# EAGLE design UMR2 CS01 r2 TPL (EAGLE 6.6.0)
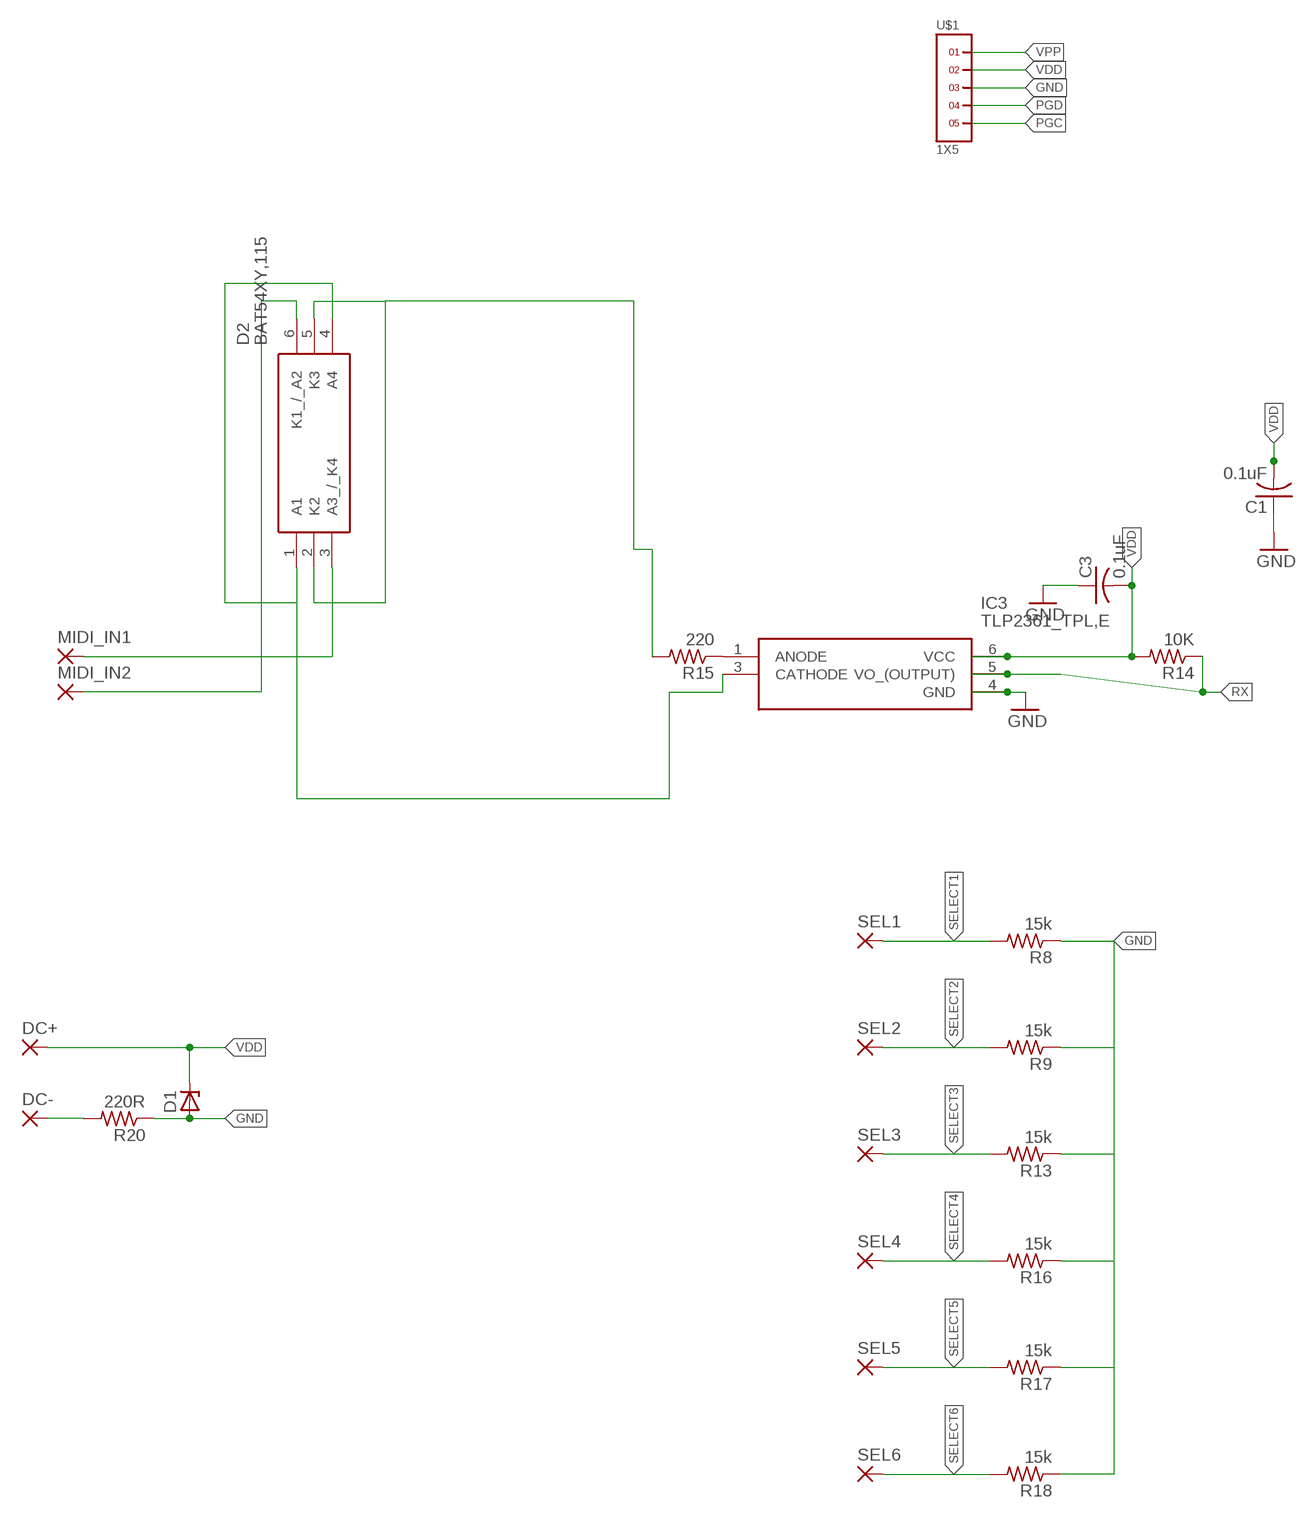
[diagram p0: schematic, sheet 1, part 1 of 2]
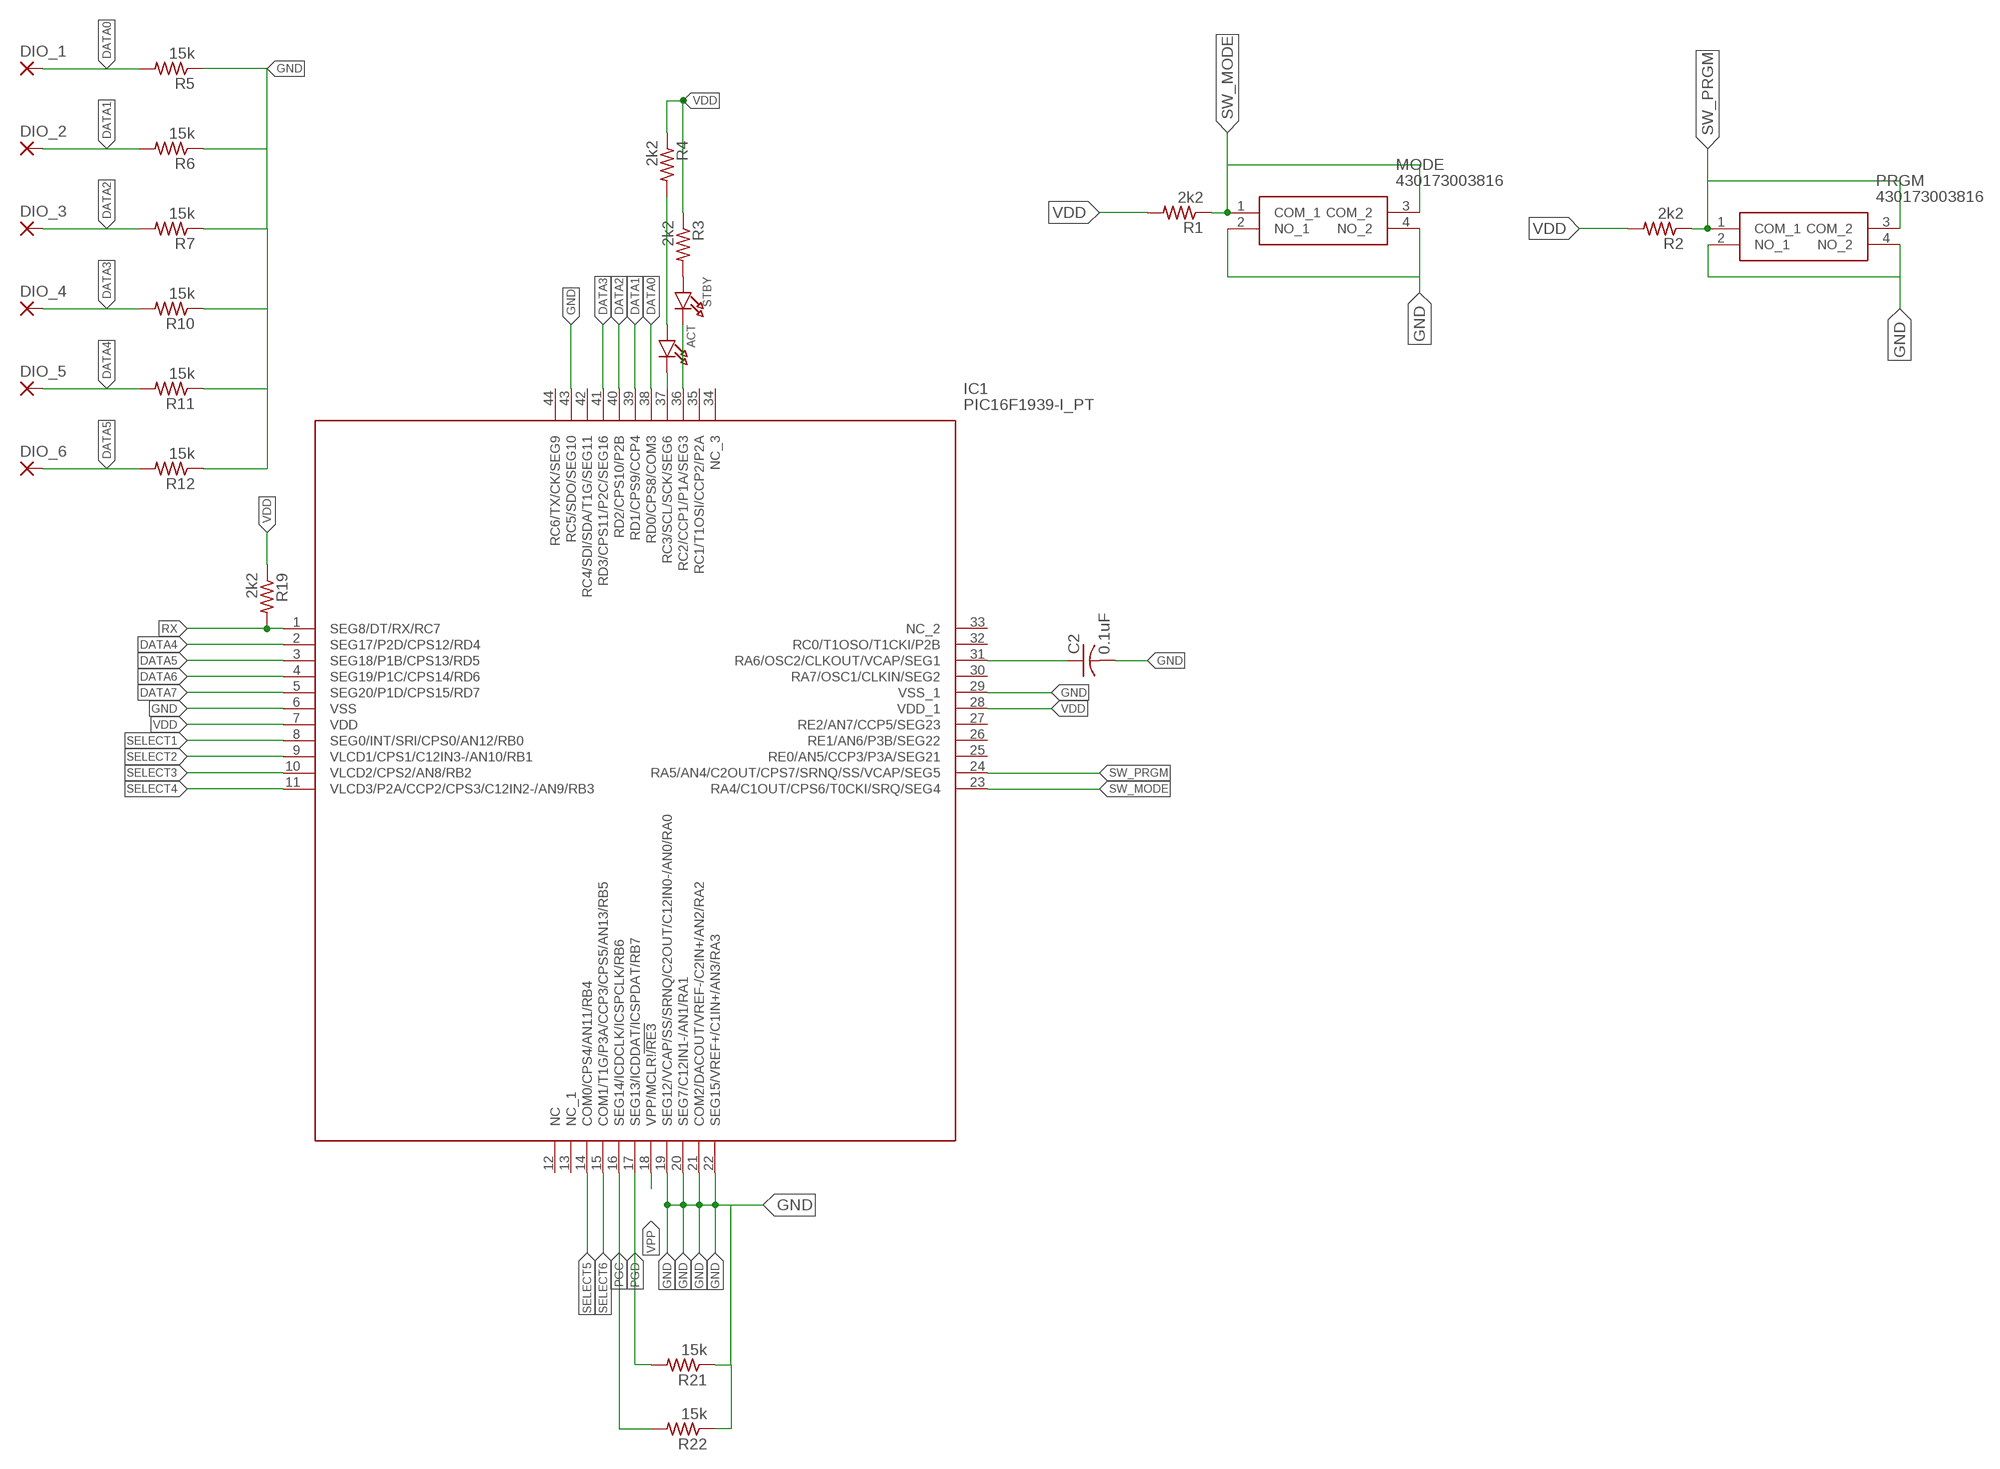
[diagram p1: schematic, sheet 1, part 2 of 2]

## Parts
ACT  LED0603_NOOUTLINE  [CHIPLED_0603_NOOUTLINE]
C1  0.1uF  RCL_C-USC0603  [RCL_C0603]
C2  0.1uF  RCL_C-USC0603  [RCL_C0603]
C3  0.1uF  RCL_C-USC0603  [RCL_C0603]
D1  ZENER_DIODESOD123  [SOD123]
D2  BAT54XY,115  [SOT65P210X110-6N]
DC+  SMD2  [SMD1,27-2,54]
DC-  SMD2  [SMD1,27-2,54]
DIO_1  SMD2  [SMD1,27-2,54]
DIO_2  SMD2  [SMD1,27-2,54]
DIO_3  SMD2  [SMD1,27-2,54]
DIO_4  SMD2  [SMD1,27-2,54]
DIO_5  SMD2  [SMD1,27-2,54]
DIO_6  SMD2  [SMD1,27-2,54]
IC1  PIC16F1939-I_PT  [QFP80P1200X1200X120-44N]
IC3  TLP2361_TPL,E  [11-4L1S(5-PIN-SOIC)]
MIDI_IN1  SMD2  [SMD1,27-2,54]
MIDI_IN2  SMD2  [SMD1,27-2,54]
MODE  430173003816  [430173003816]
PRGM  430173003816  [430173003816]
R1  2k2  RCL_R-US_R0603  [RCL_R0603]
R2  2k2  RCL_R-US_R0603  [RCL_R0603]
R3  2k2  RCL_R-US_R0603  [RCL_R0603]
R4  2k2  RCL_R-US_R0603  [RCL_R0603]
R5  15k  RCL_R-US_R0603  [RCL_R0603]
R6  15k  RCL_R-US_R0603  [RCL_R0603]
R7  15k  RCL_R-US_R0603  [RCL_R0603]
R8  15k  RCL_R-US_R0603  [RCL_R0603]
R9  15k  RCL_R-US_R0603  [RCL_R0603]
R10  15k  RCL_R-US_R0603  [RCL_R0603]
R11  15k  RCL_R-US_R0603  [RCL_R0603]
R12  15k  RCL_R-US_R0603  [RCL_R0603]
R13  15k  RCL_R-US_R0603  [RCL_R0603]
R14  10K  RCL_R-US_R0603  [RCL_R0603]
R15  220  RCL_R-US_R0603  [RCL_R0603]
R16  15k  RCL_R-US_R0603  [RCL_R0603]
R17  15k  RCL_R-US_R0603  [RCL_R0603]
R18  15k  RCL_R-US_R0603  [RCL_R0603]
R19  2k2  RCL_R-US_R0603  [RCL_R0603]
R20  220R  RCL_R-US_R0603  [RCL_R0603]
R21  15k  RCL_R-US_R0603  [RCL_R0603]
R22  15k  RCL_R-US_R0603  [RCL_R0603]
SEL1  SMD2  [SMD1,27-2,54]
SEL2  SMD2  [SMD1,27-2,54]
SEL3  SMD2  [SMD1,27-2,54]
SEL4  SMD2  [SMD1,27-2,54]
SEL5  SMD2  [SMD1,27-2,54]
SEL6  SMD2  [SMD1,27-2,54]
STBY  LED0603_NOOUTLINE  [CHIPLED_0603_NOOUTLINE]
U$1  1X5  [1X5]

## Nets
ACT: ACT.C IC1.37(RC3/SCL/SCK/SEG6)
DATA0: DIO_1.1(P) IC1.38(RD0/CPS8/COM3) R5.2
DATA1: DIO_2.1(P) IC1.39(RD1/CPS9/CCP4) R6.2
DATA2: DIO_3.1(P) IC1.40(RD2/CPS10/P2B) R7.2
DATA3: DIO_4.1(P) IC1.41(RD3/CPS11/P2C/SEG16) R10.2
DATA4: DIO_5.1(P) IC1.2(SEG17/P2D/CPS12/RD4) R11.2
DATA5: DIO_6.1(P) IC1.3(SEG18/P1B/CPS13/RD5) R12.2
DATA6: IC1.4(SEG19/P1C/CPS14/RD6)
DATA7: IC1.5(SEG20/P1D/CPS15/RD7)
GND: C1.1 C2.2 C3.1 D1.ANODE IC1.6(VSS) IC1.19(SEG12/VCAP/SS/SRNQ/C2OUT/C12IN0-/AN0/RA0) IC1.20(SEG7/C12IN1-/AN1/RA1) IC1.21(COM2/DACOUT/VREF-/C2IN+/AN2/RA2) IC1.22(SEG15/VREF+/C1IN+/AN3/RA3) IC1.29(VSS_1) IC1.43(RC5/SDO/SEG10) IC3.4(GND) MODE.2(NO_1) MODE.4(NO_2) PRGM.2(NO_1) PRGM.4(NO_2) R5.1 R6.1 R7.1 R8.1 R9.1 R10.1 R11.1 R12.1 R13.1 R16.1 R17.1 R18.1 R20.1 R21.1 R22.1 U$1.3
MIDI_IN_RING: D2.6(K1_/_A2) MIDI_IN2.1(P)
MIDI_IN_TIP: D2.3(A3_/_K4) MIDI_IN1.1(P)
N$1: IC3.1(ANODE) R15.1
N$3: D2.1(A1) D2.4(A4) IC3.3(CATHODE)
N$4: R3.2 STBY.A
N$5: ACT.A R4.2
N$6: DC-.1(P) R20.2
N$19: D2.2(K2) D2.5(K3) R15.2
PGC: IC1.16(SEG14/ICDCLK/ICSPCLK/RB6) R22.2 U$1.5
PGD: IC1.17(SEG13/ICDDAT/ICSPDAT/RB7) R21.2 U$1.4
RX: IC1.1(SEG8/DT/RX/RC7) IC3.5(VO_(OUTPUT)) R14.1 R19.2
SELECT1: IC1.8(SEG0/INT/SRI/CPS0/AN12/RB0) R8.2 SEL1.1(P)
SELECT2: IC1.9(VLCD1/CPS1/C12IN3-/AN10/RB1) R9.2 SEL2.1(P)
SELECT3: IC1.10(VLCD2/CPS2/AN8/RB2) R13.2 SEL3.1(P)
SELECT4: IC1.11(VLCD3/P2A/CCP2/CPS3/C12IN2-/AN9/RB3) R16.2 SEL4.1(P)
SELECT5: IC1.14(COM0/CPS4/AN11/RB4) R17.2 SEL5.1(P)
SELECT6: IC1.15(COM1/T1G/P3A/CCP3/CPS5/AN13/RB5) R18.2 SEL6.1(P)
STBY: IC1.36(RC2/CCP1/P1A/SEG3) STBY.C
SW_MODE: IC1.23(RA4/C1OUT/CPS6/T0CKI/SRQ/SEG4) MODE.1(COM_1) MODE.3(COM_2) R1.1
SW_PRGM: IC1.24(RA5/AN4/C2OUT/CPS7/SRNQ/SS/VCAP/SEG5) PRGM.1(COM_1) PRGM.3(COM_2) R2.1
VCAP: C2.1 IC1.31(RA6/OSC2/CLKOUT/VCAP/SEG1)
VDD: C1.2 C3.2 D1.CATHODE DC+.1(P) IC1.7(VDD) IC1.28(VDD_1) IC3.6(VCC) R1.2 R2.2 R3.1 R4.1 R14.2 R19.1 U$1.2
VPP: IC1.18(VPP/MCLR!!/RE3) U$1.1
Unconnected: IC1.12(NC) IC1.13(NC_1) IC1.25(RE0/AN5/CCP3/P3A/SEG21) IC1.26(RE1/AN6/P3B/SEG22) IC1.27(RE2/AN7/CCP5/SEG23) IC1.30(RA7/OSC1/CLKIN/SEG2) IC1.32(RC0/T1OSO/T1CKI/P2B) IC1.33(NC_2) IC1.34(NC_3) IC1.35(RC1/T1OSI/CCP2/P2A) IC1.42(RC4/SDI/SDA/T1G/SEG11) IC1.44(RC6/TX/CK/SEG9)

## Library data of the parts
ACT STBY = microbuilder:LED: LED 0603 - 0603 Surface Mount Package 2mA: Green LED - Low Power (3.9mcd, 2ma, 1.7Vf) - Digikey: 475-2709-2-ND Orange LED - Low Power (9.8mcd, 2ma, 1.8Vf) - Digikey: 475-1194-2-ND Red LED - Low Power (5mcd, 2ma, 1.8Vf) - Digikey: 475-1195-2-ND Yellow LED - Low Power (7mcd, 2ma, 1.8Vf) - Digikey: 475-1196-2-ND 5mA: Blue LED - Low Power (17mcd, 5ma, 2.9Vf) - Digikey: LNJ937W8CRACT-ND 0805 - 0805 Surface Mount Package 2mA: Red LED (8.8mcd, 2mA, 1.8Vf, Clear) - Low Power [Digikey: 475-2510-1-ND] Green LED (5mcd, 2mA, 1.8Vf, Clear) - Low Power [Digikey: 475-2730-1-ND] Yellow LED (11.3mcd, 2mA, 1.8Vf, Clear) - Low Power [Digikey: 475-2555-1-ND] 20mA: Red LED (104mcd, 20mA, Diffused) - LS R976 [Digikey: 475-1278-6-ND] Red LED (12mcd, 20mA, 2.0Vf, Clear) - APT2012EC [Digikey: 754-1128-1-ND] Green LED (15mcd, 20mA, 2.2Vf, Clear) - APT2012GC [Digikey: 754-1131-1-ND] Orange LED (160mcd, 20mA, 2.1Vf, Clear) - APT2012SECK [Digikey: 754-1130-1-ND] 1206 - 1206 Surface Mount Package Green LED (26mcd, 20mA, Diffused) - LG N971 [Digikey: 475-1407-6-ND] Red LED (15mcd, 20mA, Diffused) - LH N974 [Digikey: 475-1416-6-ND]
C1-C3 = ioboard:RCL_C-US: CAPACITOR, American symbol
D1 = fab:ZENER_DIODE: zener diode
D2 = SamacSys_Parts:BAT54XY,115: Nexperia BAT54XY,115 Quad SMT Schottky Diode, 2x Series Pair, 30V 200mA, 6-Pin SOT-363 Source: Datasheet <https://assets.nexperia.com/documents/data-sheet/BAT54XY.pdf>; DESCRIPTION: Nexperia BAT54XY,115 Quad SMT Schottky Diode, 2x Series Pair, 30V 200mA, 6-Pin SOT-363; HEIGHT: 1.1mm; MANUFACTURER_NAME: Nexperia; MANUFACTURER_PART_NUMBER: BAT54XY,115; MOUSER_PART_NUMBER: 771-BAT54XY-T/R; MOUSER_PRICE-STOCK: https://www.mouser.co.uk/ProductDetail/Nexperia/BAT54XY115?qs=me8TqzrmIYV24GB%252BtDdQuA%3D%3D
DC+ DC- DIO_1-DIO_6 MIDI_IN1 MIDI_IN2 SEL1-SEL6 = wirepad:SMD2: SMD PAD
IC1 = PIC16F1939-I_PT:PIC16F1939-I_PT: MCU, 28kB Flash,256B EEPROM,LCD,1.8-5.5V Source: Datasheet <https://datasheet.datasheetarchive.com/originals/distributors/Datasheets-SFU1/DSASFU10002417.pdf>; DESCRIPTION: MCU, 28kB Flash,256B EEPROM,LCD,1.8-5.5V; HEIGHT: 1.2mm; MANUFACTURER_NAME: Microchip; MANUFACTURER_PART_NUMBER: PIC16F1939-I/PT; MOUSER_PART_NUMBER: 579-PIC16F1939-I/PT; MOUSER_PRICE-STOCK: https://www.mouser.co.uk/ProductDetail/Microchip-Technology/PIC16F1939-I-PT?qs=DAV8Y8VhPTIMDflTVymdSA%3D%3D
IC3 = TLP2361_TPL_E:TLP2361_TPL,E: High Speed Optocouplers X36 PB Photocoupler Lo I/P cur 125 degC Source: Datasheet <https://toshiba.semicon-storage.com/info/docget.jsp?did=14229&prodName=TLP2361>; DESCRIPTION: High Speed Optocouplers X36 PB Photocoupler Lo I/P cur 125 degC; HEIGHT: mm; MANUFACTURER_NAME: Toshiba; MANUFACTURER_PART_NUMBER: TLP2361(TPL,E; MOUSER_PART_NUMBER: 757-TLP2361(TPLE; MOUSER_PRICE-STOCK: https://www.mouser.co.uk/ProductDetail/Toshiba/TLP2361TPLE?qs=HVbQlW5zcXUn%252BfokbzIatg%3D%3D
MODE PRGM = 430173003816:430173003816: TACT SWITCH 3.7X3.7MM VERTICAL T Source: Datasheet <https://katalog.we-online.de/em/datasheet/430173003816.pdf>; DESCRIPTION: TACT SWITCH 3.7X3.7MM VERTICAL T; HEIGHT: 0.5mm; MANUFACTURER_NAME: Wurth Elektronik; MANUFACTURER_PART_NUMBER: 430173003816; MOUSER_PART_NUMBER: 710-430173003816; MOUSER_PRICE-STOCK: https://www.mouser.co.uk/ProductDetail/Wurth-Elektronik/430173003816?qs=sPbYRqrBIVk4BdTRBhTUwg%3D%3D
R1-R22 = warps_v30:RCL_R-US_: RESISTOR, American symbol
U$1 = headers(2mm)(samtec):1X5

## Board
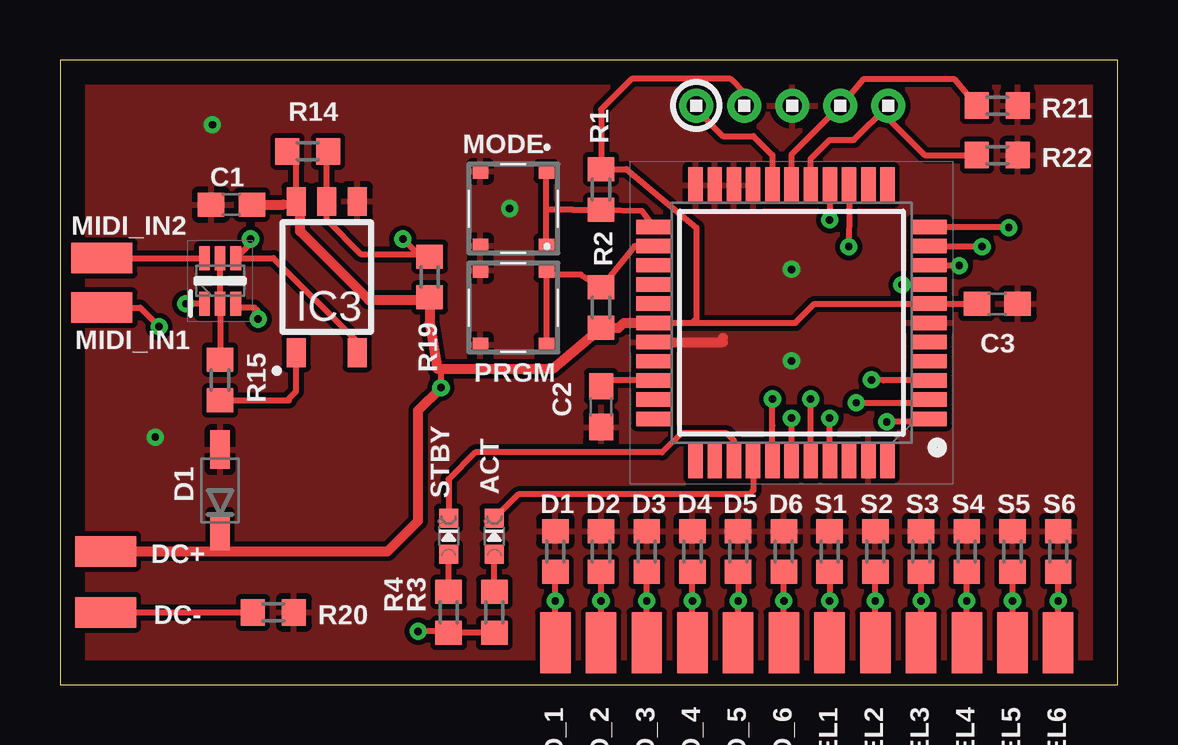
[diagram p2: board, top side]
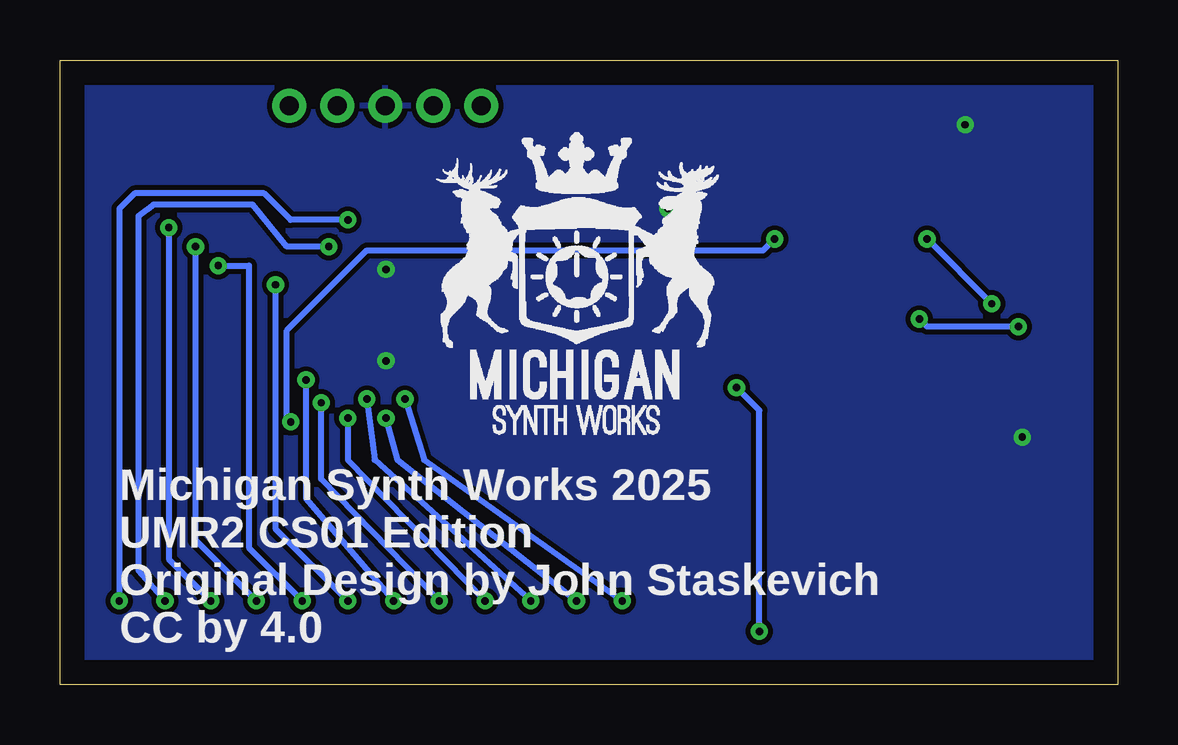
[diagram p3: board, bottom side, seen from below]

Size 44.06 x 26.03 mm. Coordinates in mm from the lower left corner, seen from the top.
Outline: 0,0 44.06,0 44.06,26.03 0,26.03 0,0
Copper layers (1*16): Top 0.035mm / dielectric 1.5mm / Bottom 0.035mm
Design rules "default": minimum track width 10mil, minimum drill 24mil, track to track 8mil, track to pad 8mil, pad to pad 8mil, via to via 8mil, smd to smd 8mil, copper to edge 40mil, drill to drill 8mil, minimum pad ring 10mil, minimum via ring 8mil, stop-mask expansion 4mil, vias tented up to drill 25mil, thermal gap 10mil

### Footprints (pad centres in the part's own frame; a part is rotated, then mirrored left to right if it is on the bottom)
CHIPLED_0603_NOOUTLINE = smd 0.8 x 0.8: A 0,-0.75; C 0,0.75
RCL_C0603 = smd 1.1 x 1: 1 -0.85,0; 2 0.85,0
SOD123 = smd 1.6 x 0.8: ANODE 1.7,0; CATHODE -1.7,0
SOT65P210X110-6N = smd 1 x 0.45: 1 -0.95,0.65; 2 -0.95,0; 3 -0.95,-0.65; 4 0.95,-0.65; 5 0.95,0; 6 0.95,0.65
SMD1,27-2,54 = smd 1.27 x 2.54: 1 0,0
QFP80P1200X1200X120-44N = smd 1.475 x 0.6: 1 -5.738,4; 2 -5.738,3.2; 3 -5.738,2.4; 4 -5.738,1.6; 5 -5.738,0.8; 6 -5.738,0; 7 -5.738,-0.8; 8 -5.738,-1.6; 9 -5.738,-2.4; 10 -5.738,-3.2; 11 -5.738,-4; 23 5.738,-4; 24 5.738,-3.2; 25 5.738,-2.4; 26 5.738,-1.6; 27 5.738,-0.8; 28 5.738,0; 29 5.738,0.8; 30 5.738,1.6; 31 5.738,2.4; 32 5.738,3.2; 33 5.738,4 | smd 0.6 x 1.475: 12 -4,-5.738; 13 -3.2,-5.738; 14 -2.4,-5.738; 15 -1.6,-5.738; 16 -0.8,-5.738; 17 0,-5.738; 18 0.8,-5.738; 19 1.6,-5.738; 20 2.4,-5.738; 21 3.2,-5.738; 22 4,-5.738; 34 4,5.738; 35 3.2,5.738; 36 2.4,5.738; 37 1.6,5.738; 38 0.8,5.738; 39 0,5.738; 40 -0.8,5.738; 41 -1.6,5.738; 42 -2.4,5.738; 43 -3.2,5.738; 44 -4,5.738
11-4L1S(5-PIN-SOIC) = smd 0.8 x 1.2: 1 -1.27,-3.15; 3 1.27,-3.15; 4 1.27,3.15; 5 0,3.15; 6 -1.27,3.15
430173003816 = smd 0.6 x 0.65: 1 -1.55,1.375; 2 -1.55,-1.375; 3 1.55,1.375; 4 1.55,-1.375
RCL_R0603 = smd 1 x 1.1: 1 -0.85,0; 2 0.85,0
1X5 = drill 0.8 pad 1.422: 1 0,0; 2 2,0; 3 4,0; 4 6,0; 5 8,0

### Placement (x,y rotation side)
ACT  18.1,6.19 0 top
C1  7.14,20 0 top
C2  22.54,11.59 270 top
C3  39.05,15.88 180 top
D1  6.67,8.1 90 top
D2  6.67,16.83 90 top
DC+  1.91,5.56 90 top
DC-  1.91,3.02 90 top
DIO_1  20.64,1.75 0 top
DIO_2  22.54,1.75 0 top
DIO_3  24.45,1.75 0 top
DIO_4  26.35,1.75 180 top
DIO_5  28.26,1.75 0 top
DIO_6  30.16,1.75 0 top
IC1  30.48,15.08 180 top
IC3  11.11,16.99 0 top
MIDI_IN1  1.75,15.72 270 top
MIDI_IN2  1.75,17.78 90 top
MODE  18.89,19.84 270 top
PRGM  18.89,15.72 270 top
R1  22.54,20.64 90 top
R2  22.54,15.72 270 top
R3  16.19,3.02 90 top
R4  18.1,3.02 90 top
R5  20.64,5.56 270 top
R6  22.54,5.56 270 top
R7  24.45,5.56 270 top
R8  32.07,5.56 270 top
R9  33.97,5.56 270 top
R10  26.35,5.56 270 top
R11  28.26,5.56 270 top
R12  30.16,5.56 270 top
R13  35.88,5.56 270 top
R14  10.32,22.23 180 top
R15  6.67,12.7 90 top
R16  37.78,5.56 270 top
R17  39.69,5.56 270 top
R18  41.59,5.56 270 top
R19  15.4,16.99 90 top
R20  8.89,3.02 180 top
R21  39.05,24.13 180 top
R22  39.05,22.07 180 top
SEL1  32.07,1.75 0 top
SEL2  33.97,1.75 180 top
SEL3  35.88,1.75 180 top
SEL4  37.78,1.75 180 top
SEL5  39.69,1.75 180 top
SEL6  41.59,1.75 180 top
STBY  16.19,6.19 0 top
U$1  26.51,24.13 0 top
U$2  [MSW_LOGO_0.5"]  22.54,16.99 0 top

### Tracks (layer width: path | path; a pad name or v marks a point on that pad's centre or on a via)
ACT
  Top 0.254: IC1.37 28.88,8.11 28.89,8.1 28.73,7.94 19.09,7.94 ACT.C
DATA0  (via drill 0.3)
  Top 0.254: IC1.38 29.68,10.8 v29.69,11.91 | R5.2 v20.64,3.49 DIO_1.1
  Bottom 0.254: v29.69,11.91 28.89,9.37 v20.64,3.49
DATA1  (via drill 0.3)
  Top 0.254: IC1.39 v30.48,11.11 | R6.2 v22.54,3.49 DIO_2.1
  Bottom 0.254: v30.48,11.11 30,9.37 v22.54,3.49
DATA2  (via drill 0.3)
  Top 0.254: IC1.40 31.28,11.74 v31.27,11.91 | R7.2 v24.45,3.49 DIO_3.1
  Bottom 0.254: v31.27,11.91 30.96,9.37 v24.45,3.49
DATA3  (via drill 0.3)
  Top 0.254: IC1.41 32.08,10.94 v32.07,11.11 | R10.2 v26.35,3.49 DIO_4.1
  Bottom 0.254: v32.07,11.11 32.07,9.37 v26.35,3.49
DATA4  (via drill 0.3)
  Top 0.254: R11.2 v28.26,3.49 DIO_5.1 | v33.18,11.75 36.08,11.75 IC1.2
  Bottom 0.254: v28.26,3.49 33.18,8.57 v33.18,11.75
DATA5  (via drill 0.3)
  Top 0.254: IC1.3 34.31,12.68 v33.81,12.7 | R12.2 v30.16,3.49 DIO_6.1
  Bottom 0.254: v33.81,12.7 33.81,7.78 v30.16,3.49
GND  (via drill 0.3)
  Top 0.406: IC1.29 27.62,14.28 27.62,14.45
  other vias: 6.35,23.34 3.97,10.32 18.73,19.84 6.35,23.34 30.48,17.3 30.48,13.49
  pour Top: -1.27,-0.79 -1.27,28.42 51.75,30.96 51.75,-0.79
  pour Bottom: -1.27,27.15 45.4,27.15 45.4,-0.79 -1.27,-0.79
MIDI_IN_RING
  Top 0.254: MIDI_IN2.1 D2.6
MIDI_IN_TIP  (via drill 0.3)
  Top 0.254: MIDI_IN1.1 3.33,15.72 v4.13,14.92 | v8.25,15.24 8.25,15.56 8.1,15.72 7.48,15.72 D2.3
  Bottom 0.254: v4.13,14.92 7.94,14.92 v8.25,15.24
N$1
  Top 0.254: R15.1 9.54,11.85 9.54,11.92 9.84,12.22 IC3.1
N$3  (via drill 0.3)
  Top 0.254: D2.1 v5.24,15.88 | v7.94,18.57 7.94,18.4 D2.4 8.89,17.78 12.38,14.29 IC3.3
  Bottom 0.254: v5.24,15.88 v7.94,18.57
N$4
  Top 0.254: R3.2 STBY.A
N$5
  Top 0.254: R4.2 ACT.A
N$6
  Top 0.254: DC-.1 R20.2
N$19
  Top 0.254: D2.5 D2.2 R15.2
PGC
  Top 0.254: IC1.16 31.28,21.91 32.07,22.7 33.08,22.7 U$1.5 34.51,23.59 36.04,22.07 R22.2
PGD
  Top 0.254: IC1.17 30.48,22.1 U$1.4 32.54,24.13 33.5,25.24 37.25,25.24 R21.2
RX  (via drill 0.3)
  Top 0.254: 14.92,17.94 12.54,17.94 11.11,19.37 IC3.5 11.11,22.17 R14.1 | 14.92,17.94 15.3,17.94 R19.2 | IC1.1 36.35,10.95 v34.45,10.95 | v14.29,18.57 14.92,17.94
  Top 0.406: 11.43,22.49 R14.1 11.27,22.49
  Bottom 0.254: v34.45,10.95 34.61,10.95 34.61,14.76 31.27,18.1 14.76,18.1 v14.29,18.57
SELECT1  (via drill 0.3)
  Top 0.254: IC1.8 35.1,16.68 v35.08,16.67 | SEL1.1 v32.07,3.49 R8.2
  Bottom 0.254: v35.08,16.67 35.08,6.51 v32.07,3.49
SELECT2  (via drill 0.3)
  Top 0.254: IC1.9 37.45,17.48 v37.47,17.46 | R9.2 v33.97,3.49 SEL2.1
  Bottom 0.254: v37.47,17.46 36.19,17.46 36.19,5.72 v33.97,3.49
SELECT3  (via drill 0.3)
  Top 0.254: IC1.10 38.39,18.28 v38.42,18.26 | R13.2 v35.88,3.49 SEL3.1
  Bottom 0.254: v38.42,18.26 38.42,6.03 v35.88,3.49
SELECT4  (via drill 0.3)
  Top 0.254: IC1.11 39.5,19.08 v39.53,19.05 | R16.2 v37.78,3.49 SEL4.1
  Bottom 0.254: v39.53,19.05 39.53,5.24 v37.78,3.49
SELECT5  (via drill 0.3)
  Top 0.254: IC1.14 32.88,19.83 v32.86,18.26 | R17.2 v39.69,3.49 SEL5.1
  Bottom 0.254: v32.86,18.26 34.61,18.26 36.04,20 40.16,20 40.8,19.53 40.8,4.76 v39.69,3.49
SELECT6  (via drill 0.3)
  Top 0.254: IC1.15 32.08,19.38 v32.07,19.37 | R18.2 v41.59,3.49 SEL6.1
  Bottom 0.254: v32.07,19.37 34.45,19.37 35.56,20.48 40.96,20.48 41.59,19.84 v41.59,3.49
STBY
  Top 0.254: IC1.36 28.08,10.18 27.78,10.48 25.88,10.48 25.08,9.68 17.3,9.68 16.19,8.57 STBY.C
SW_MODE
  Top 0.254: IC1.23 24.24,19.74 R1.1 21.38,19.79 20.27,19.79 | 20.27,19.79 MODE.1 | MODE.3 20.27,19.79
SW_PRGM
  Top 0.254: IC1.24 23.94,18.28 R2.1 21.7,17.09 20.27,17.09 PRGM.1 PRGM.3
VCAP
  Top 0.254: IC1.31 22.31,12.68 C2.1
VDD  (via drill 0.3)
  Top 0.254: IC1.28 26.35,15.08 | 26.35,15.08 30.64,15.08 31.43,15.88 36.21,15.88 IC1.7 C3.2 | 26.35,15.08 26.51,15.24 26.51,19.05 23.6,21.49 R1.2 22.54,23.97 23.81,25.24 27.94,25.24 28.51,24.67 U$1.2 | R4.1 R3.1 16.14,2.22 v14.92,2.22 | v15.87,12.38 15.87,13.02 15.72,13.18 | R14.2 9.84,21.85 IC3.6 9.71,20 9.32,20
  Top 0.406: IC1.28 23.49,15.08 23.28,14.87 R2.2 20.53,13.18 15.72,13.18 15.4,15.08 R19.1 15.3,16.03 12.86,16.03 10,18.89 10,19.98 IC3.6 | C1.2 9.32,20 | DC+.1 6.67,5.56 | 6.67,5.56 13.65,5.56 14.92,6.83 14.92,11.43 v15.87,12.38 | D1.CATHODE 6.67,5.56
  Bottom 0.254: v14.92,2.22 14.92,11.43 v15.87,12.38
VPP
  Top 0.254: U$1.1 26.51,23.97 27.62,22.86 28.89,22.86 29.69,22.07 IC1.18

### Text on the board
tPlace: D1 | D2 | D3 | D4 | D5 | D6 | S1 | S2 | S3 | S4 | S5 | S6
bNames: Michigan Synth Works 2025 / UMR2 CS01 Edition / Original Design by John Staskevich / CC by 4.0